# EAGLE design Grove-Sound Recorder V1.1 (EAGLE 5.10)
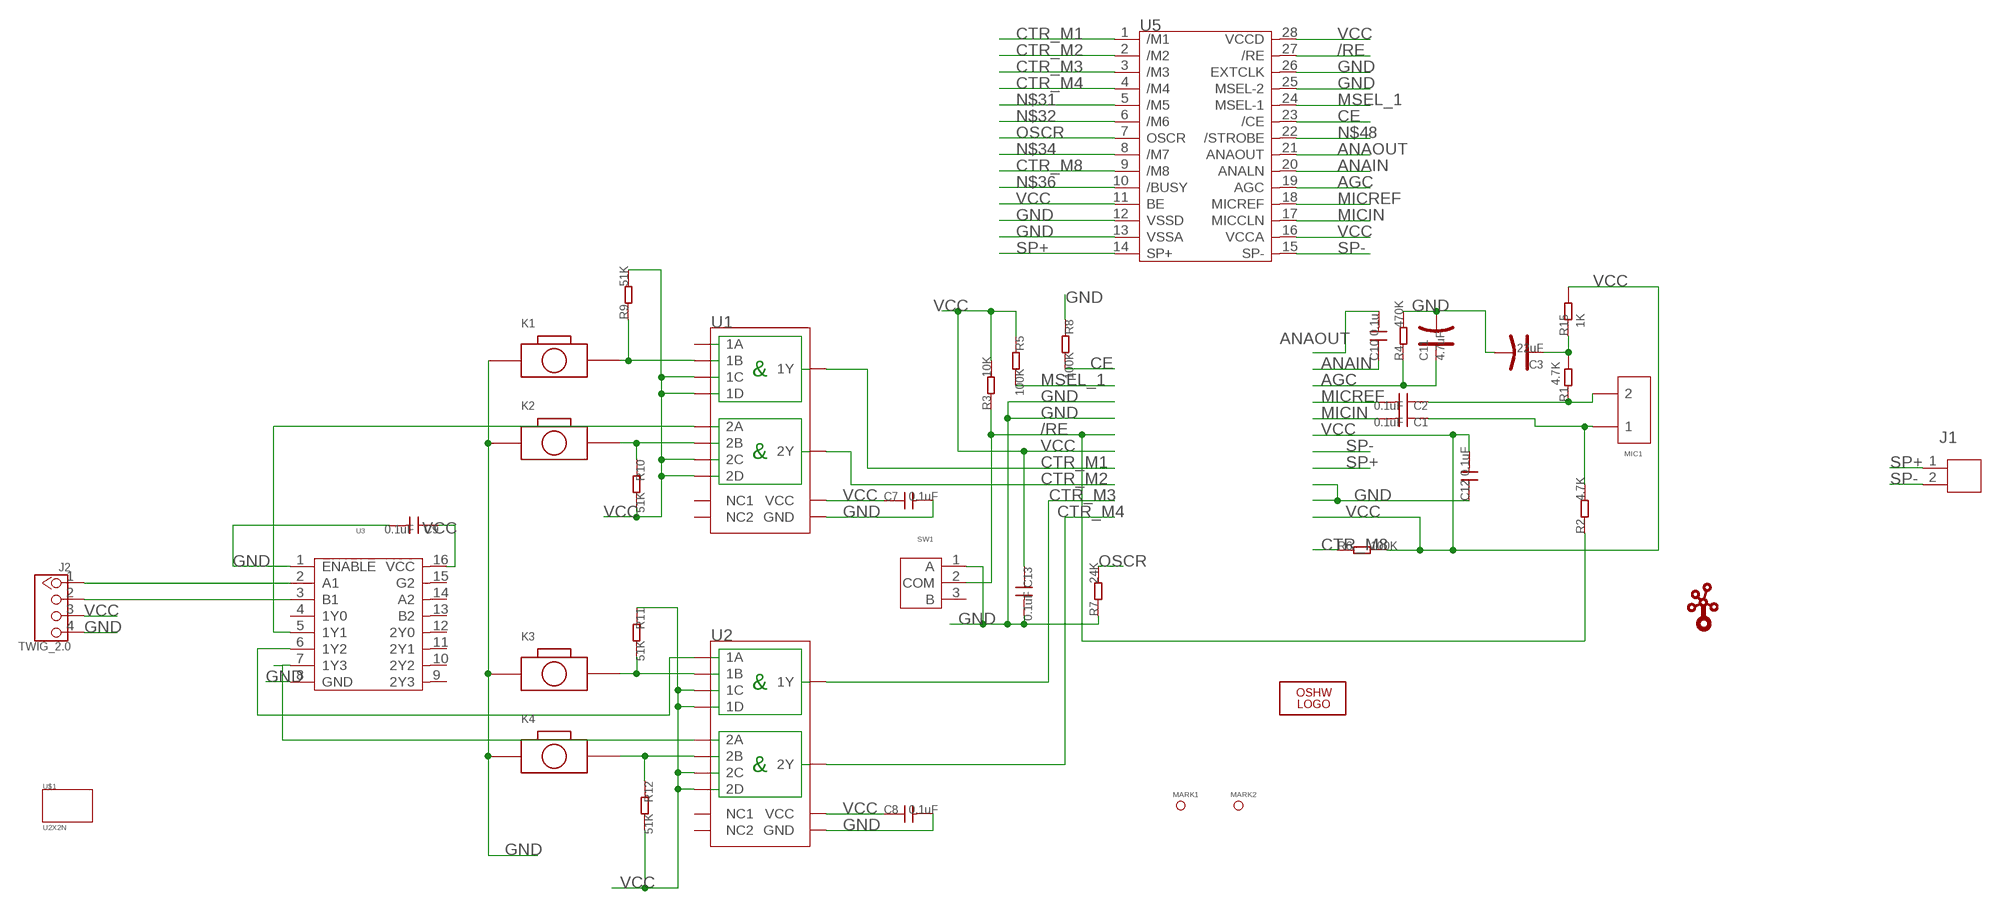
[diagram p0: schematic, sheet 1]

## Parts
C1  0.1uF  006-C35*40  [0603]
C2  0.1uF  006-C35*40  [0603]
C3  22uF  CAP_AVX_A  [AVX-A]
C7  0.1uF  006-C35*40  [0603]
C8  0.1uF  006-C35*40  [0603]
C9  0.1uF  006-C35*40  [0603]
C10  0.1u  006-C35*40  [0603]
C11  4.7uF  006-CAP_AVX_C  [AVX_C]
C12  0.1uF  006-C35*40  [0603]
C13  0.1uF  006-C35*40  [0603]
J1  JST-2P-2.0  [2P-2.0-LEADED-4.7X6.0]
J2  TWIG_2.0  [2.0_1X4]
K1  BOTTON_1_DP  [BTN_5.0_RST]
K2  BOTTON_1_DP  [BTN_5.0_RST]
K3  BOTTON_1_DP  [BTN_5.0_RST]
K4  BOTTON_1_DP  [BTN_5.0_RST]
LOGO2  LOGO-OSHW-FILLX0200-NT  [OSHW_FILLX200_NOTEXT]
MARK1  PAD-MARK  [MARK]
MARK2  PAD-MARK  [MARK]
MIC1  MINI-MICROPHONE  [MINI-MICROPHONE]
R1  4.7K  005-R0603_S  [0603_S]
R2  4.7K  005-R0603_S  [0603_S]
R3  10K  005-R0603_S  [0603_S]
R4  470K  005-R0603_S  [0603_S]
R5  100K  005-R0603_S  [0603_S]
R6  100K  005-R0603_S  [0603_S]
R7  24K  005-R0603_S  [0603_S]
R8  100K  005-R0603_S  [0603_S]
R9  51K  005-R0603_S  [0603_S]
R10  51K  005-R0603_S  [0603_S]
R11  51K  005-R0603_S  [0603_S]
R12  51K  005-R0603_S  [0603_S]
R15  1K  005-R0603_S  [0603_S]
SW1  SWITCH-2H-3P-LEADED  [3P-LEADED-2.54-8.8X4.6]
U1  74HC21SO14  [SO14]
U2  74HC21SO14  [SO14]
U3  MM74HC139-M16A  [SOIC16]
U5  APR9600-DIP28  [DIP28]
U$1  U2X2N  [U2X2N]
U$2  TWIGLOGO  [TWIGLOGO]

## Nets
/RE: R2.1 R3.1 SW1.2(COM) U5.27(/RE)
AGC: C11.+ R4.1 U5.19(AGC)
ANAIN: C10.1 U5.20(ANALN)
ANAOUT: C10.2 U5.21(ANAOUT)
CE: R8.2 U5.23(/CE)
CTR_M1: U1.6(1Y) U5.1(/M1)
CTR_M2: U1.8(2Y) U5.2(/M2)
CTR_M3: U2.6(1Y) U5.3(/M3)
CTR_M4: U2.8(2Y) U5.4(/M4)
CTR_M8: R6.1 U5.9(/M8)
GND: C3.- C7.2 C8.2 C9.2 C11.- C12.1 C13.2 J2.4 K1.P$1 K2.P$1 K3.P$1 K4.P$1 R4.2 R7.1 R8.1 SW1.1(A) U1.7(GND) U2.7(GND) U3.1(ENABLE) U3.8(GND) U5.12(VSSD) U5.13(VSSA) U5.25(MSEL-2) U5.26(EXTCLK)
MICIN: C1.2 U5.17(MICCLN)
MICREF: C2.2 U5.18(MICREF)
MSEL_1: R5.2 U5.24(MSEL-1)
N$1: K1.P$2 R9.1 U1.2(1B)
N$2: K2.P$2 R10.1 U1.10(2B)
N$3: K3.P$2 R11.2 U2.2(1B)
N$4: K4.P$2 R12.1 U2.10(2B)
N$5: J2.1 U3.2(A1)
N$6: J2.2 U3.3(B1)
N$7: C3.+ R1.2 R15.1
N$8: U1.9(2A) U3.5(1Y1)
N$10: U2.1(1A) U3.6(1Y2)
N$11: U2.9(2A) U3.7(1Y3)
N$28: C1.1 MIC1.P$1 R2.2
N$29: C2.1 MIC1.P$2 R1.1
N$31: U5.5(/M5)
N$32: U5.6(/M6)
N$34: U5.8(/M7)
N$36: U5.10(/BUSY)
N$48: U5.22(/STROBE)
OSCR: R7.2 U5.7(OSCR)
SP+: J1.1 U5.14(SP+)
SP-: J1.2 U5.15(SP-)
VCC: C7.1 C8.1 C9.1 C12.2 C13.1 J2.3 R3.2 R5.1 R6.2 R9.2 R10.2 R11.1 R12.2 R15.2 U1.4(1C) U1.5(1D) U1.12(2C) U1.13(2D) U1.14(VCC) U2.4(1C) U2.5(1D) U2.12(2C) U2.13(2D) U2.14(VCC) U3.16(VCC) U5.11(BE) U5.16(VCCA) U5.28(VCCD)
Unconnected: SW1.3(B) U1.1(1A) U1.3(NC1) U1.11(NC2) U2.3(NC1) U2.11(NC2) U3.4(1Y0) U3.9(2Y3) U3.10(2Y2) U3.11(2Y1) U3.12(2Y0) U3.13(B2) U3.14(A2) U3.15(G2)

## Library data of the parts
C1 C2 C7-C10 C12 C13 = Discrete:006-C*: Ceramic Capacitors
C3 = Discrete:CAP*: Electrolytic Capacitors,Tantalum Capacitors and Super Capacitors
C11 = Discrete:006-CAP*: Electrolytic Capacitors,Tantalum Capacitors and Super Capacitors
J1 = Connector:JST-2P-2.0
J2 = CONNECTER:TWIG_2.0
K1-K4 = CPT_SMD:BOTTON_1
LOGO2 = Logo:LOGO-OSHW-FILL
MARK1 MARK2 = Discrete:PAD-MARK
MIC1 = Discrete:MINI-MICROPHONE
R1-R12 R15 = Discrete:005-R*
SW1 = Discreter:SWITCH-2H-3P-LEADED
U1 U2 = ICs:74HC21
U3 = IC:MM74HC139: http://eshop.engineering.uiowa.edu/NI/pdfs/00/53/DS005311.pdf
U5 = IC:APR9600-DIP28: Single-Chip Voice Recording & Playback Device 60-Second Duration
U$1 = twig_template1:U2X2N
U$2 = seeedleo:TWIGLOGO

## Net classes
0 default: width 0.152 mm, drill 0.305 mm, clearance 0.152 mm

## Board
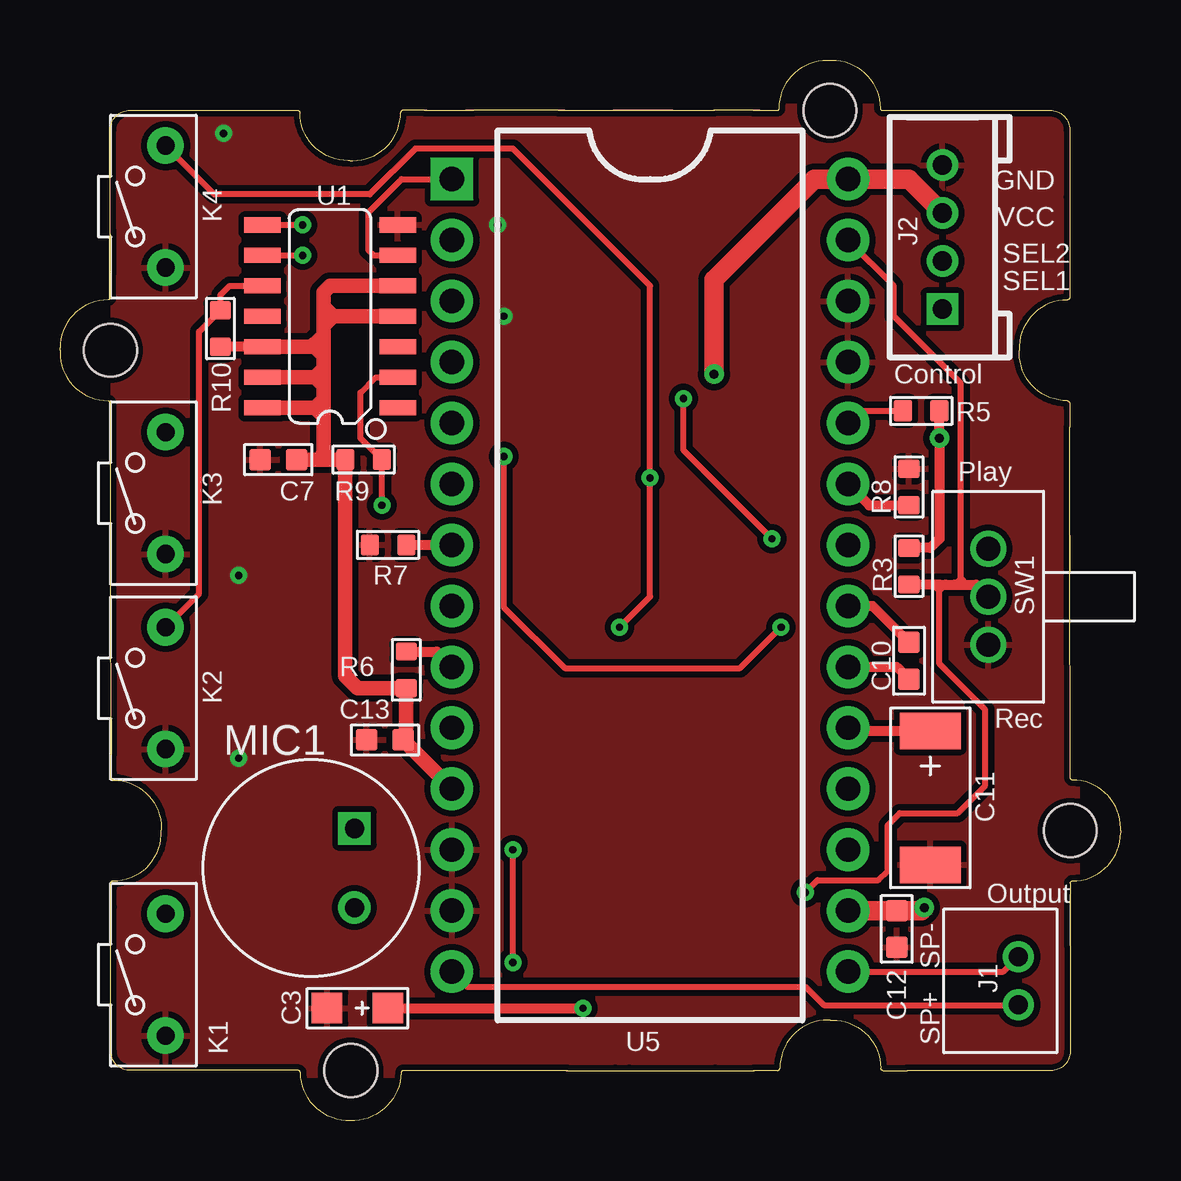
[diagram p1: board, top side]
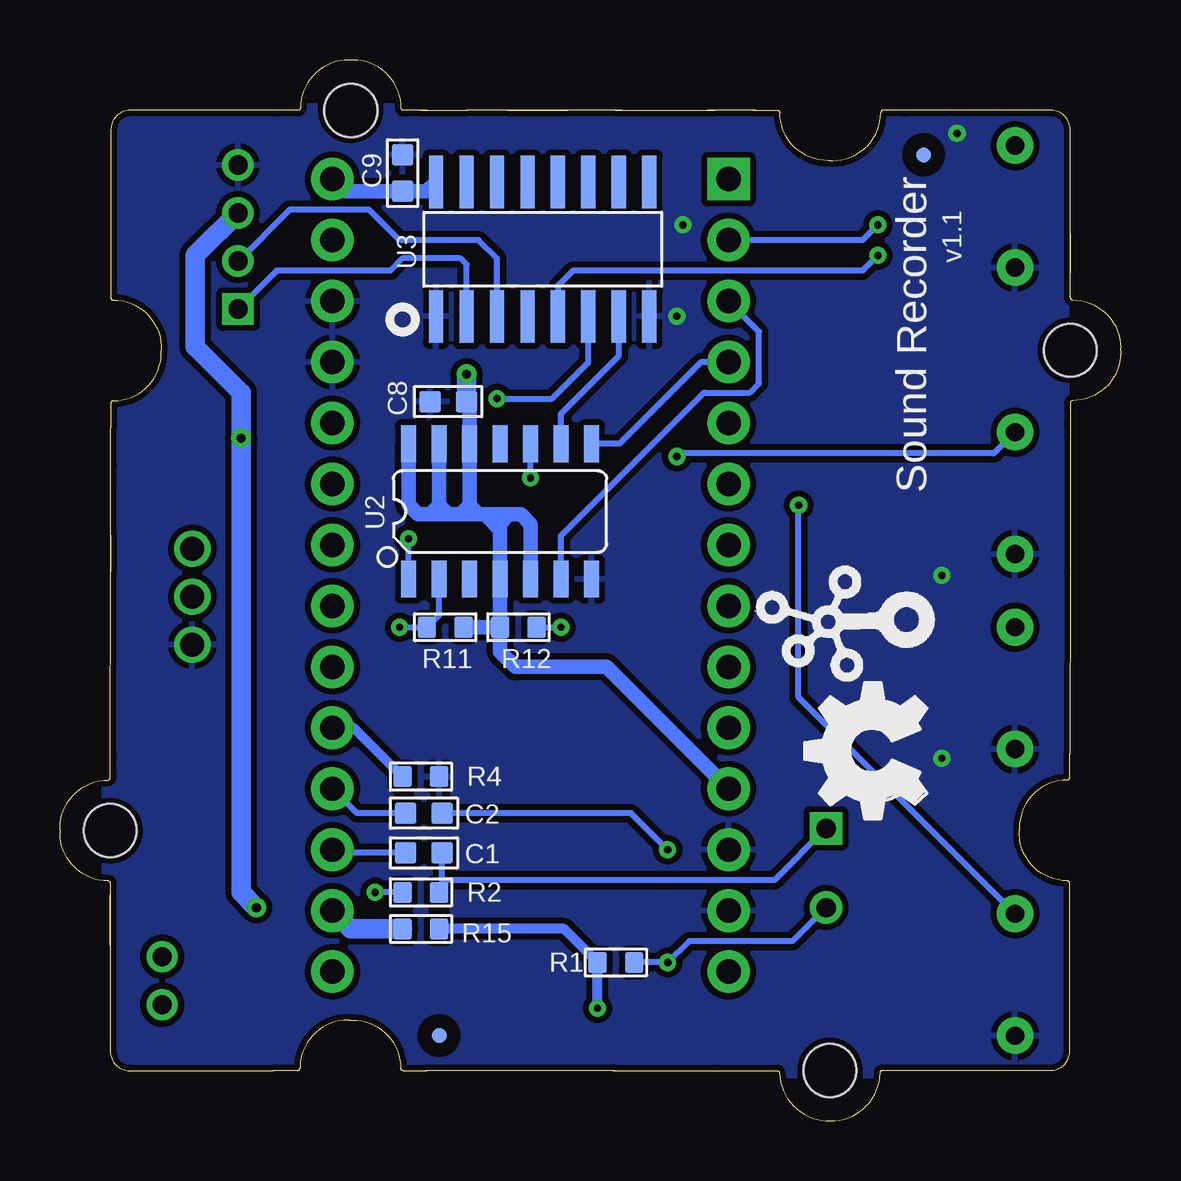
[diagram p2: board, bottom side, seen from below]

Size 44.21 x 44.2 mm. Coordinates in mm from the lower left corner, seen from the top.
Copper layers (1*16): Top 0.035mm / dielectric 1.5mm / Bottom 0.035mm
Design rules "default *": minimum track width 10mil, minimum drill 12mil, track to track 8mil, track to pad 8mil, pad to pad 8mil, via to via 8mil, smd to smd 8mil, copper to edge 10mil, drill to drill 10mil, minimum pad ring 10mil, minimum via ring 8mil, stop-mask expansion 4mil, vias tented up to drill 25mil, thermal gap 10mil

### Footprints (pad centres in the part's own frame; a part is rotated, then mirrored left to right if it is on the bottom)
0603 = smd 0.889 x 0.889: 1 -0.762,0; 2 0.762,0
AVX-A = smd 1.27 x 1.27: + -1.27,0; - 1.27,0
AVX_C = smd 1.524 x 2.54: + -2.794,0; - 2.794,0
2P-2.0-LEADED-4.7X6.0 = drill 0.8 pad 1.3 round: 1 -1,-0.75; 2 1,-0.75
2.0_1X4 = drill 0.8 pad 1.27 square: 1 -3,0 | drill 0.8 pad 1.27 round: 2 -1,0; 3 1,0; 4 3,0
BTN_5.0_RST = drill 0.762 pad 1.524 round: P$1 0,2.54; P$2 0,-2.54
MARK = smd 0.635 x 0.635: P$1 0,0
MINI-MICROPHONE = drill 0.8 pad 1.35 square: P$1 -1.65,0 | drill 0.8 pad 1.35 round: P$2 1.65,0
0603_S = smd 0.762 x 0.889: 1 -0.762,0; 2 0.762,0
3P-LEADED-2.54-8.8X4.6 = drill 1 pad 1.5 round: 1 -2,0; 2 0,0; 3 2,0
SO14 = smd 0.635 x 1.524: 1 -3.81,-2.819; 2 -2.54,-2.819; 3 -1.27,-2.819; 4 0,-2.819; 5 1.27,-2.819; 6 2.54,-2.819; 7 3.81,-2.819; 8 3.81,2.819; 9 2.54,2.819; 10 1.27,2.819; 11 0,2.819; 12 -1.27,2.819; 13 -2.54,2.819; 14 -3.81,2.819
SOIC16 = smd 0.6 x 2.2: 1 -4.445,-2.8; 2 -3.175,-2.8; 3 -1.905,-2.8; 4 -0.635,-2.8; 5 0.635,-2.8; 6 1.905,-2.8; 7 3.175,-2.8; 8 4.445,-2.8; 9 4.445,2.8; 10 3.175,2.8; 11 1.905,2.8; 12 0.635,2.8; 13 -0.635,2.8; 14 -1.905,2.8; 15 -3.175,2.8; 16 -4.445,2.8
DIP28 = drill 1.016 pad 1.778 square: 1 -16.51,-8.255 | drill 1.016 pad 1.778 round: 2 -13.97,-8.255; 3 -11.43,-8.255; 4 -8.89,-8.255; 5 -6.35,-8.255; 6 -3.81,-8.255; 7 -1.27,-8.255; 8 1.27,-8.255; 9 3.81,-8.255; 10 6.35,-8.255; 11 8.89,-8.255; 12 11.43,-8.255; 13 13.97,-8.255; 14 16.51,-8.255; 15 16.51,8.255; 16 13.97,8.255; 17 11.43,8.255; 18 8.89,8.255; 19 6.35,8.255; 20 3.81,8.255; 21 1.27,8.255; 22 -1.27,8.255; 23 -3.81,8.255; 24 -6.35,8.255; 25 -8.89,8.255; 26 -11.43,8.255; 27 -13.97,8.255; 28 -16.51,8.255
U2X2N = hole 2.2: 10.033,20.01; -19.955,10.015; -9.933,-19.99; 20.055,-9.995

### Placement (x,y rotation side)
C1  29.04,11.17 180 bottom
C2  29.04,12.82 180 bottom
C3  12.4,4.69 180 top
C7  9.1,27.55 180 top
C8  28.02,29.96 180 bottom
C9  29.93,39.49 90 bottom
C10  35.39,19.17 90 top
C11  36.28,13.45 270 top
C12  34.88,7.99 90 top
C13  13.55,15.87 180 top
J1  39.2,5.83 90 top
J2  36.79,36.82 90 top
K1  4.4,6.09 180 top
K2  4.4,18.03 180 top
K3  4.4,26.15 180 top
K4  4.4,38.09 180 top
LOGO2  8.09,12.58 90 bottom
MARK1  28.41,3.55 0 bottom
MARK2  8.21,40.25 0 bottom
MIC1  12.28,10.53 270 top
R1  21.04,6.6 180 bottom
R2  29.17,9.52 0 bottom
R3  35.39,23.11 90 top
R4  29.17,14.34 0 bottom
R5  35.9,29.58 180 top
R6  14.44,18.79 270 top
R7  13.67,23.99 0 top
R8  35.39,26.41 270 top
R9  12.66,27.55 180 top
R10  6.69,33.01 270 top
R11  28.15,20.57 180 bottom
R12  25.1,20.57 180 bottom
R15  29.17,7.99 180 bottom
SW1  38.69,21.84 90 top
U1  11.26,33.52 90 top
U2  25.87,25.39 0 bottom
U3  24.09,36.31 0 bottom
U5  24.59,22.72 270 top
U$1  22.05,22.09 0 top
U$2  8.72,20.82 90 bottom

### Tracks (layer width: path | path; a pad name or v marks a point on that pad's centre or on a via)
/RE  (via drill 0.3 pad 0.64)
  Top 0.254: U5.27 34.76,34.79 34.76,33.52 37.55,30.73 37.55,22.6 | 37.42,22.34 37.55,22.47 37.55,22.6 | v31.07,9.52 31.58,10.02 34.12,10.02 34.5,10.41 34.5,12.31 35.01,12.82 37.42,12.82 38.57,13.96 38.57,17.14 36.66,19.04 36.66,22.09 | 36.66,22.09 36.66,22.34 | 36.66,22.09 36.91,22.34 | 36.66,22.09 36.41,22.34 | 37.55,22.6 37.68,22.47 | 37.3,22.34 37.55,22.6
  Top 0.406: R3.1 36.41,22.34 36.66,22.34 36.91,22.34 37.3,22.34 37.42,22.34 38.18,22.34 SW1.2
  Bottom 0.254: R2.1 v31.07,9.52
AGC
  Top 0.406: C11.+ 32.98,16.25 U5.19
  Bottom 0.406: U5.19 31.96,16.37 R4.1
ANAIN
  Top 0.406: U5.20 34.88,18.91 C10.1
ANAOUT
  Top 0.406: U5.21 33.87,21.45 C10.2
CE
  Top 0.406: R8.2 33.74,25.65 U5.23
CTR_M1
  Top 0.254: U1.6 13.07,36.06 12.85,36.28 12.85,37.84 14.24,39.23 U5.1
CTR_M2  (via drill 0.3 pad 0.64)
  Top 0.254: U1.8 v10.12,37.33
  Bottom 0.254: U5.2 10.75,36.69 v10.12,37.33
CTR_M3
  Bottom 0.254: U2.6 23.33,24.38 17.36,30.34 15.45,30.34 15.07,30.73 15.07,32.88 U5.3
CTR_M4
  Bottom 0.254: U2.8 20.89,28.21 17.48,31.61 U5.4
CTR_M8
  Top 0.406: R6.1 15.71,19.55 U5.9
GND  (via drill 0.3 pad 0.64)
  other vias: 18.5,33.52 18.25,37.33 6.82,41.14 7.45,22.72 7.45,15.11
  pour Top (isolate 0.254): 2.24,42.28 42.38,42.28 42.38,1.9 2.24,1.9
  pour Bottom (isolate 0.254): 2.24,42.28 42.38,42.28 42.38,1.9 2.24,1.9
MICIN
  Bottom 0.254: C1.2 32.72,11.17 U5.17
MICREF
  Bottom 0.254: C2.2 31.83,12.82 U5.18
MSEL_1
  Top 0.254: R5.2 33.36,29.58 U5.24
N$1  (via drill 0.3 pad 0.64)
  Top 0.254: U1.2 13.16,30.98 12.53,30.34 12.53,28.44 R9.1 v13.42,25.65
  Bottom 0.254: v13.42,25.65 13.42,17.64 K1.P$2
N$2
  Top 0.254: U1.10 7.07,34.79 6.69,34.41 R10.1 5.8,32.88 5.8,21.96 K2.P$2
N$3  (via drill 0.3 pad 0.64)
  Top 0.254: v18.5,27.68 18.5,21.4 21.05,18.86 28.35,18.86 v30.06,20.57
  Bottom 0.254: v18.5,27.68 18.37,27.8 5.29,27.8 K3.P$2 | U2.2 28.41,21.07 R11.2 v30.06,20.57
N$4  (via drill 0.3 pad 0.64)
  Top 0.254: K4.P$2 6.43,38.6 12.91,38.6 14.82,40.5 18.88,40.5 24.59,34.79 v24.59,26.79 24.59,21.84 v23.33,20.57
  Bottom 0.254: v24.59,26.79 U2.10 | R12.1 v23.33,20.57
N$5
  Bottom 0.254: U3.2 27.26,35.68 27.52,35.93 29.93,35.93 30.44,35.42 35.18,35.42 J2.1
N$6
  Bottom 0.254: J2.2 36.77,35.82 34.63,37.97 31.33,37.97 30.06,36.69 26.75,36.69 25.99,35.93 U3.3
N$7  (via drill 0.3 pad 0.64)
  Top 0.406: C3.+ v21.8,4.69
  Bottom 0.406: R15.1 23.2,7.99 R1.2 v21.8,4.69
N$8  (via drill 0.3 pad 0.64)
  Top 0.254: U1.9 v10.12,36.06 | U1.9 8.09,36.06 7.96,36.19 8.31,36.19 U1.9
  Bottom 0.254: U3.5 23.45,34.79 22.82,35.42 10.75,35.42 v10.12,36.06
N$10  (via drill 0.3 pad 0.64)
  Top 0.254: v25.99,30.09 25.99,27.93 v29.68,24.25
  Bottom 0.254: U3.6 22.18,31.61 23.71,30.09 v25.99,30.09 | U2.1 v29.68,24.25
N$11
  Bottom 0.254: U3.7 20.91,31.87 23.33,29.46 U2.9
N$28
  Bottom 0.254: R2.2 28.28,9.64 28.28,10.02 | 28.28,10.02 C1.1 | 28.28,10.02 14.43,10.02 MIC1.P$1
N$29  (via drill 0.3 pad 0.64)
  Top 0.254: v18.88,6.6 v18.88,11.29
  Bottom 0.254: C2.1 20.4,12.82 v18.88,11.29 | R1.1 v18.88,6.6 17.99,7.48 13.67,7.48 MIC1.P$2
OSCR
  Top 0.406: R7.2 U5.7
SP+
  Top 0.254: U5.14 16.98,5.58 31.07,5.58 31.83,4.82 39.93,4.82 J1.1
SP-
  Top 0.254: U5.15 39.33,6.21 J1.2
VCC  (via drill 0.38 pad 0.81)
  Top 0.406: R5.1 v36.66,28.44 36.66,24.25 36.28,23.87 R3.2 | U1.12 R10.2 | 11.39,27.55 11.01,27.93 | 10.99,27.55 10.99,28.04 11.01,28.06 11.01,27.93 | 11.01,27.93 10.62,27.55
  Top 0.61: 10.99,27.55 11.39,27.55 R9.2 11.9,18.53 12.4,18.03 R6.2 14.44,15.99 C13.1 U5.11 | 10.99,27.55 10.62,27.55 C7.1 | 10.99,27.55 10.99,29.84 | 10.99,29.84 10.99,30.98 | 10.99,30.98 10.99,31.87 | 10.99,31.87 10.99,33.52 | 10.99,33.52 10.99,34.52 11.26,34.79 U1.5 | 10.99,33.52 11.39,33.52 | 10.5,32.25 10.61,32.25 10.99,31.87 | 10.99,30.98 10.62,30.98 | 10.62,30.98 U1.13 | 10.62,29.71 10.86,29.71 10.99,29.84 | 10.62,29.71 U1.14 | 11.39,33.52 11.01,33.9 | 11.39,33.52 U1.4 | 11.39,33.52 11.01,33.14 | 10.5,32.25 U1.12 | 10.5,32.25 10.88,32.63 | 10.62,30.98 10.88,31.23 | 10.62,30.98 10.88,30.73 | 10.62,29.71 10.88,29.96 | 10.62,29.71 10.88,29.46
  Top 0.813: J2.3 36.79,37.84 35.39,39.23 U5.28 31.45,39.23 27.26,35.04 v27.26,31.11 | U5.16 C12.2 35.9,8.75 v36.02,8.88
  Bottom 0.406: 25.87,20.31 R12.2
  Bottom 0.61: U5.28 32.34,38.73 C9.1 28.92,38.73 U3.16 | 38.57,32.25 38.57,36.04 J2.3 | C8.1 27.13,29.84 U2.12 27.13,25.65 | R11.1 R12.2 U2.4 25.87,24.63 | 25.87,20.31 25.87,19.55 25.23,18.91 21.42,18.91 U5.11 | 26.5,25.26 26.75,25.26 | 26.75,25.26 27.13,25.26 | 26.5,25.26 25.48,25.26 | 25.48,25.26 25,25.26 24.59,24.86 U2.5 | 27.13,25.26 27.52,25.26 | 27.52,25.26 28.02,25.26 | 28.02,25.26 28.41,25.26 | 28.41,25.26 28.79,25.26 | 28.79,25.26 29.27,25.26 29.68,25.67 U2.14 | 28.41,25.26 28.41,25.65 | 27.13,25.26 27.13,25.65 | 25.87,24.63 26.5,25.26 | 25.87,24.63 25.87,24.88 25.48,25.26 | 27.13,25.65 27.52,25.26 | 26.75,25.26 27.13,25.65 | 28.41,25.65 28.79,25.26 | 28.41,25.65 U2.13 | 28.02,25.26 28.41,25.65
  Bottom 0.813: R15.2 32.09,7.99 U5.16 | C8.1 v27.26,31.11 | 36.66,37.97 38.57,36.06 38.57,32.25 36.66,30.34 v36.66,28.44 36.66,9.52 v36.02,8.88

### Text on the board
tPlace: GND | VCC | SEL2 | SEL1 | Control | Play | Rec | Output | SP- | SP+
bPlace: Sound Recorder | v1.1